# Altium schematic sheet APP_1_DAC_m.SchDoc
size Tabloid; SheetNumber: 13; SheetTotal: 15; Sheet_Name: DAC; Size: 11x17
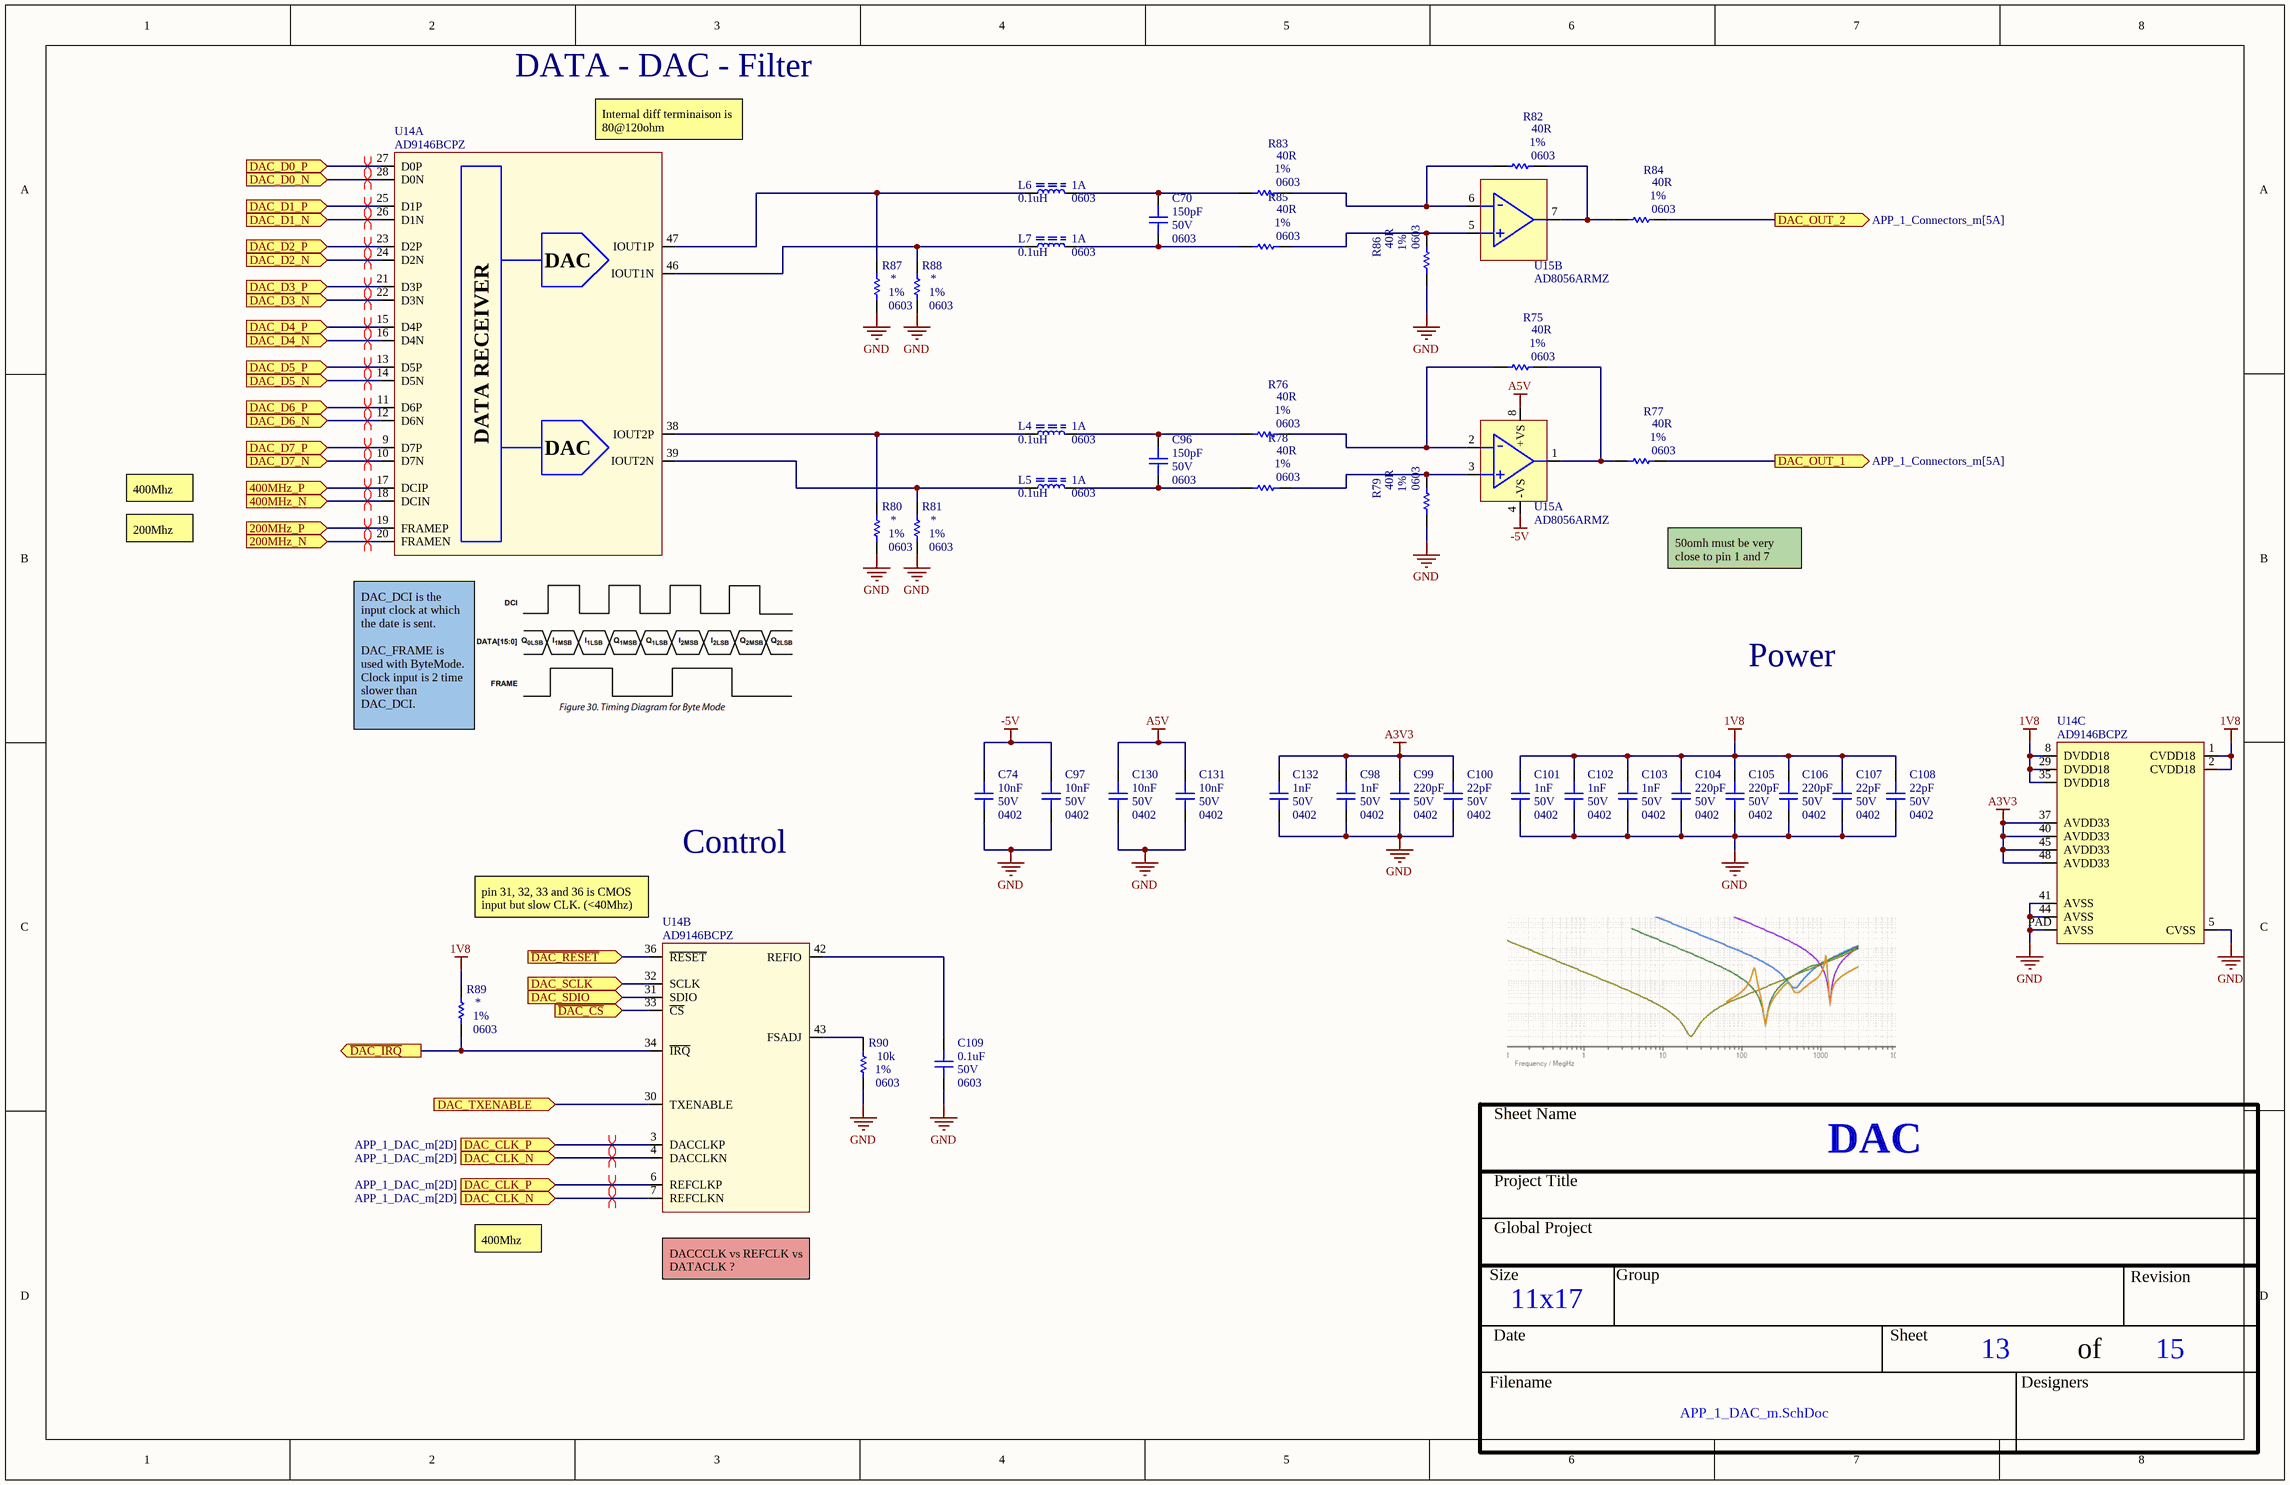
[diagram p0: APP_1_DAC_m.SchDoc]

## Parts
C70  value 150pF  Voltage: 50V  Package: 0603  [CAP_0603]  (hidden comment: CAP - 0603)
C74  value 10nF  Voltage: 50V  Package: 0402  [CAP_0402]  (hidden comment: CAP - 0402)
C96  value 150pF  Voltage: 50V  Package: 0603  [CAP_0603]  (hidden comment: CAP - 0603)
C97  value 10nF  Voltage: 50V  Package: 0402  [CAP_0402]  (hidden comment: CAP - 0402)
C98  value 1nF  Voltage: 50V  Package: 0402  [CAP_0402]  (hidden comment: CAP - 0402)
C99  value 220pF  Voltage: 50V  Package: 0402  [CAP_0402]  (hidden comment: CAP - 0402)
C100  value 22pF  Voltage: 50V  Package: 0402  [CAP_0402]  (hidden comment: CAP - 0402)
C101  value 1nF  Voltage: 50V  Package: 0402  [CAP_0402]  (hidden comment: CAP - 0402)
C102  value 1nF  Voltage: 50V  Package: 0402  [CAP_0402]  (hidden comment: CAP - 0402)
C103  value 1nF  Voltage: 50V  Package: 0402  [CAP_0402]  (hidden comment: CAP - 0402)
C104  value 220pF  Voltage: 50V  Package: 0402  [CAP_0402]  (hidden comment: CAP - 0402)
C105  value 220pF  Voltage: 50V  Package: 0402  [CAP_0402]  (hidden comment: CAP - 0402)
C106  value 220pF  Voltage: 50V  Package: 0402  [CAP_0402]  (hidden comment: CAP - 0402)
C107  value 22pF  Voltage: 50V  Package: 0402  [CAP_0402]  (hidden comment: CAP - 0402)
C108  value 22pF  Voltage: 50V  Package: 0402  [CAP_0402]  (hidden comment: CAP - 0402)
C109  value 0.1uF  Voltage: 50V  Package: 0603  [CAP_0603]  (hidden comment: CAP - 0603)
C130  value 10nF  Voltage: 50V  Package: 0402  [CAP_0402]  (hidden comment: CAP - 0402)
C131  value 10nF  Voltage: 50V  Package: 0402  [CAP_0402]  (hidden comment: CAP - 0402)
C132  value 1nF  Voltage: 50V  Package: 0402  [CAP_0402]  (hidden comment: CAP - 0402)
L4  value 0.1uH  Current: 1A  Package: 0603  [FER_0603]  (hidden comment: FER - 0603)
L5  value 0.1uH  Current: 1A  Package: 0603  [FER_0603]  (hidden comment: FER - 0603)
L6  value 0.1uH  Current: 1A  Package: 0603  [FER_0603]  (hidden comment: FER - 0603)
L7  value 0.1uH  Current: 1A  Package: 0603  [FER_0603]  (hidden comment: FER - 0603)
R75  value 40R  Package: 0603  Precision: 1%  [RES_0603]  (hidden comment: RES - 0603)
R76  value 40R  Package: 0603  Precision: 1%  [RES_0603]  (hidden comment: RES - 0603)
R77  value 40R  Package: 0603  Precision: 1%  [RES_0603]  (hidden comment: RES - 0603)
R78  value 40R  Package: 0603  Precision: 1%  [RES_0603]  (hidden comment: RES - 0603)
R79  value 40R  Package: 0603  Precision: 1%  [RES_0603]  (hidden comment: RES - 0603)
R80  Package: 0603  Precision: 1%  [RES_0603]  (hidden comment: RES - 0603)
R81  Package: 0603  Precision: 1%  [RES_0603]  (hidden comment: RES - 0603)
R82  value 40R  Package: 0603  Precision: 1%  [RES_0603]  (hidden comment: RES - 0603)
R83  value 40R  Package: 0603  Precision: 1%  [RES_0603]  (hidden comment: RES - 0603)
R84  value 40R  Package: 0603  Precision: 1%  [RES_0603]  (hidden comment: RES - 0603)
R85  value 40R  Package: 0603  Precision: 1%  [RES_0603]  (hidden comment: RES - 0603)
R86  value 40R  Package: 0603  Precision: 1%  [RES_0603]  (hidden comment: RES - 0603)
R87  Package: 0603  Precision: 1%  [RES_0603]  (hidden comment: RES - 0603)
R88  Package: 0603  Precision: 1%  [RES_0603]  (hidden comment: RES - 0603)
R89  Package: 0603  Precision: 1%  [RES_0603]  (hidden comment: RES - 0603)
R90  value 10k  Package: 0603  Precision: 1%  [RES_0603]  (hidden comment: RES - 0603)
U14  AD9146BCPZ  [DAC_AD9146BCPZ]  (parts A,B,C of 3)
U15  AD8056ARMZ  [OPAMP_AD8056ARMZ]  (parts A,B of 2)

## Ports
200MHz_N (in, see APP_1_PLL_m[3C]), 200MHz_P (in, see APP_1_PLL_m[3C]), 400MHz_N (in, see APP_1_PLL_m[3C]), 400MHz_P (in, see APP_1_PLL_m[3C]), DAC_CLK_N (in, see APP_1_DAC_m[2D]), DAC_CLK_P (in, see APP_1_DAC_m[2D]), DAC_D0_N (in), DAC_D0_P (in), DAC_D1_N (in), DAC_D1_P (in), DAC_D2_N (in), DAC_D2_P (in), DAC_D3_N (in), DAC_D3_P (in), DAC_D4_N (in), DAC_D4_P (in), DAC_D5_N (in), DAC_D5_P (in), DAC_D6_N (in), DAC_D6_P (in), DAC_D7_N (in), DAC_D7_P (in), DAC_OUT_1 (out, see APP_1_Connectors_m[5A]), DAC_OUT_2 (out, see APP_1_Connectors_m[5A]), DAC_SCLK (in), DAC_SDIO (in), DAC_TXENABLE (in), ~{DAC_CS} (in), ~{DAC_IRQ} (out), ~{DAC_RESET} (in)

## Nets
1V8: C101.2 C102.2 C103.2 C104.2 C105.2 C106.2 C107.2 C108.2 R89.2 U14.1(CVDD18) U14.2(CVDD18) U14.8(DVDD18) U14.29(DVDD18) U14.35(DVDD18)
-5V: C74.2 C97.2 U15.4(-VS)
A3V3: C98.2 C99.2 C100.2 C132.2 U14.37(AVDD33) U14.40(AVDD33) U14.45(AVDD33) U14.48(AVDD33)
A5V: C130.2 C131.2 U15.8(+VS)
GND: C74.1 C97.1 C98.1 C99.1 C100.1 C101.1 C102.1 C103.1 C104.1 C105.1 C106.1 C107.1 C108.1 C109.1 C130.1 C131.1 C132.1 R79.2 R80.1 R81.1 R86.2 R87.1 R88.1 R90.1 U14.5(CVSS) U14.41(AVSS) U14.44(AVSS) U14.PAD(AVSS)
200MHz_N: U14.20(FRAMEN) ; port 200MHz_N
200MHz_P: U14.19(FRAMEP) ; port 200MHz_P
400MHz_N: U14.18(DCIN) ; port 400MHz_N
400MHz_P: U14.17(DCIP) ; port 400MHz_P
~{DAC_CS}: U14.33(~{CS}) ; port ~{DAC_CS}
~{DAC_IRQ}: R89.1 U14.34(~{IRQ}) ; port ~{DAC_IRQ}
~{DAC_RESET}: U14.36(~{RESET}) ; port ~{DAC_RESET}
DAC_CLK_N: U14.4(DACCLKN) U14.7(REFCLKN) ; port DAC_CLK_N
DAC_CLK_P: U14.3(DACCLKP) U14.6(REFCLKP) ; port DAC_CLK_P
DAC_D0_N: U14.28(D0N) ; port DAC_D0_N
DAC_D0_P: U14.27(D0P) ; port DAC_D0_P
DAC_D1_N: U14.26(D1N) ; port DAC_D1_N
DAC_D1_P: U14.25(D1P) ; port DAC_D1_P
DAC_D2_N: U14.24(D2N) ; port DAC_D2_N
DAC_D2_P: U14.23(D2P) ; port DAC_D2_P
DAC_D3_N: U14.22(D3N) ; port DAC_D3_N
DAC_D3_P: U14.21(D3P) ; port DAC_D3_P
DAC_D4_N: U14.16(D4N) ; port DAC_D4_N
DAC_D4_P: U14.15(D4P) ; port DAC_D4_P
DAC_D5_N: U14.14(D5N) ; port DAC_D5_N
DAC_D5_P: U14.13(D5P) ; port DAC_D5_P
DAC_D6_N: U14.12(D6N) ; port DAC_D6_N
DAC_D6_P: U14.11(D6P) ; port DAC_D6_P
DAC_D7_N: U14.10(D7N) ; port DAC_D7_N
DAC_D7_P: U14.9(D7P) ; port DAC_D7_P
DAC_OUT_1: R77.1 ; port DAC_OUT_1
DAC_OUT_2: R84.1 ; port DAC_OUT_2
DAC_SCLK: U14.32(SCLK) ; port DAC_SCLK
DAC_SDIO: U14.31(SDIO) ; port DAC_SDIO
DAC_TXENABLE: U14.30(TXENABLE) ; port DAC_TXENABLE
NetC70_1: C70.1 L7.1 R85.2
NetC70_2: C70.2 L6.1 R83.2
NetC96_1: C96.1 L5.1 R78.2
NetC96_2: C96.2 L4.1 R76.2
NetC109_2: C109.2 U14.42(REFIO)
NetL4_2: L4.2 R80.2 U14.38(IOUT2P)
NetL5_2: L5.2 R81.2 U14.39(IOUT2N)
NetL6_2: L6.2 R87.2 U14.47(IOUT1P)
NetL7_2: L7.2 R88.2 U14.46(IOUT1N)
NetR75_1: R75.1 R77.2 U15.1(OUT1)
NetR75_2: R75.2 R76.1 U15.2(-IN1)
NetR78_1: R78.1 R79.1 U15.3(+IN1)
NetR82_1: R82.1 R84.2 U15.7(OUT2)
NetR82_2: R82.2 R83.1 U15.6(-IN2)
NetR85_1: R85.1 R86.1 U15.5(+IN2)
NetR90_2: R90.2 U14.43(FSADJ)

## Layout directives
differential pair: 200MHz_N, 200MHz_P, 400MHz_N, 400MHz_P, DAC_CLK_N, DAC_CLK_P, DAC_D0_N, DAC_D0_P, DAC_D1_N, DAC_D1_P, DAC_D2_N, DAC_D2_P, DAC_D3_N, DAC_D3_P, DAC_D4_N, DAC_D4_P, DAC_D5_N, DAC_D5_P, DAC_D6_N, DAC_D6_P, DAC_D7_N, DAC_D7_P

## Notes on the sheet
- DATA - DAC - Filter
- (near U14) Internal diff terminaison is 80@120ohm
- 400Mhz
- 200Mhz
- 50omh must be very close to pin 1 and 7
- Power
- (near U14) DAC_DCI is the input clock at which the date is sent.
  DAC_FRAME is used with ByteMode. Clock input is 2 time slower than DAC_DCI.
- Control
- (near U14) pin 31, 32, 33 and 36 is CMOS input but slow CLK. (<40Mhz)
- (near U14) DACCCLK vs REFCLK vs DATACLK ?
- Sheet Name
- Project Title
- Global Project
- Size
- Group
- Revision
- Date
- Sheet
- of
- Filename
- Designers
- (in symbol DAC_AD9146BCPZ, part A) DAC; DATA RECEIVER

## Library data of the parts
C70 C96 C109 = CAP - 0603: Precision: 10%; Current: *; CreatedBy: Jonathan Bouchard; Power: *
C74 C97-C108 C130-C132 = CAP - 0402: Precision: 10%; Current: *; CreatedBy: Jonathan Bouchard; Power: *
U14 = DAC_AD9146BCPZ: DAC - 16BIT SRL HIGH SPEED - QFN-48; Voltage: 3.13 V ~ 3.47 V / 1.71 V ~ 1.89 V; Mfg: Analog Devices Inc.; Current: *; Power: *; Mfg Part Number: AD9146BCPZ; HelpURL: http://www.analog.com/media/en/technical-documentation/data-sheets/AD9146.PDF; CreatedBy: Jonathan Bouchard; Temperature: -40°C ~ 85°C; Value: *; Precision: 16 Bit; Package: QFN-48; Supplier 1: Digikey; Supplier Part Number 1: AD9146BCPZ-ND
U15 = OPAMP_AD8056ARMZ: OPAMP - VFB 300MHZ - 8MSOP; Voltage: 8 V ~ 12 V, ±4 V ~ 6 V; Current: 60mA; Mfg: Analog Devices; Power: *; Mfg Part Number: AD8056ARMZ; HelpURL: http://www.analog.com/media/en/technical-documentation/data-sheets/AD8055_8056.pdf; CreatedBy: Jonathan Bouchard; Temperature: -40°C ~ 125°C; Value: *; Precision: *; Package: MSOP-8; Supplier 1: Digikey; Supplier Part Number 1: AD8056ARMZ-REEL7CT-ND
L4-L7 = FER - 0603: Voltage: *; CreatedBy: Jonathan Bouchard; Power: *; Precision: *
R75-R90 = RES - 0603: Current: *; CreatedBy: Jonathan Bouchard
  R80 R81 R87-R89: Value: *